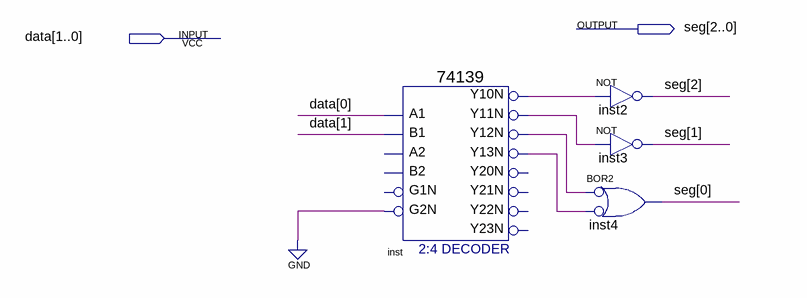
[diagram p0: schematic sheet]
// Quartus schematic decoder2-3.bdf as structural Verilog: 4 symbols, 2 pins
module \decoder2-3  (
  input  [1:0] data,
  output [2:0] seg
);

  wire inst_y10n, inst_y11n, inst_y12n, inst_y13n;

  \74139  inst (
    .A1(data[0]), .B1(data[1]), .G2N(1'b0), .Y10N(inst_y10n), .Y13N(inst_y13n), .Y12N(inst_y12n),
    .Y11N(inst_y11n));  // open: A2, B2, G1N, Y20N, Y21N, Y22N, Y23N
  or inst4 (seg[0], ~inst_y12n, ~inst_y13n);  // BOR2
  not inst2 (seg[2], inst_y10n);
  not inst3 (seg[1], inst_y11n);
endmodule
